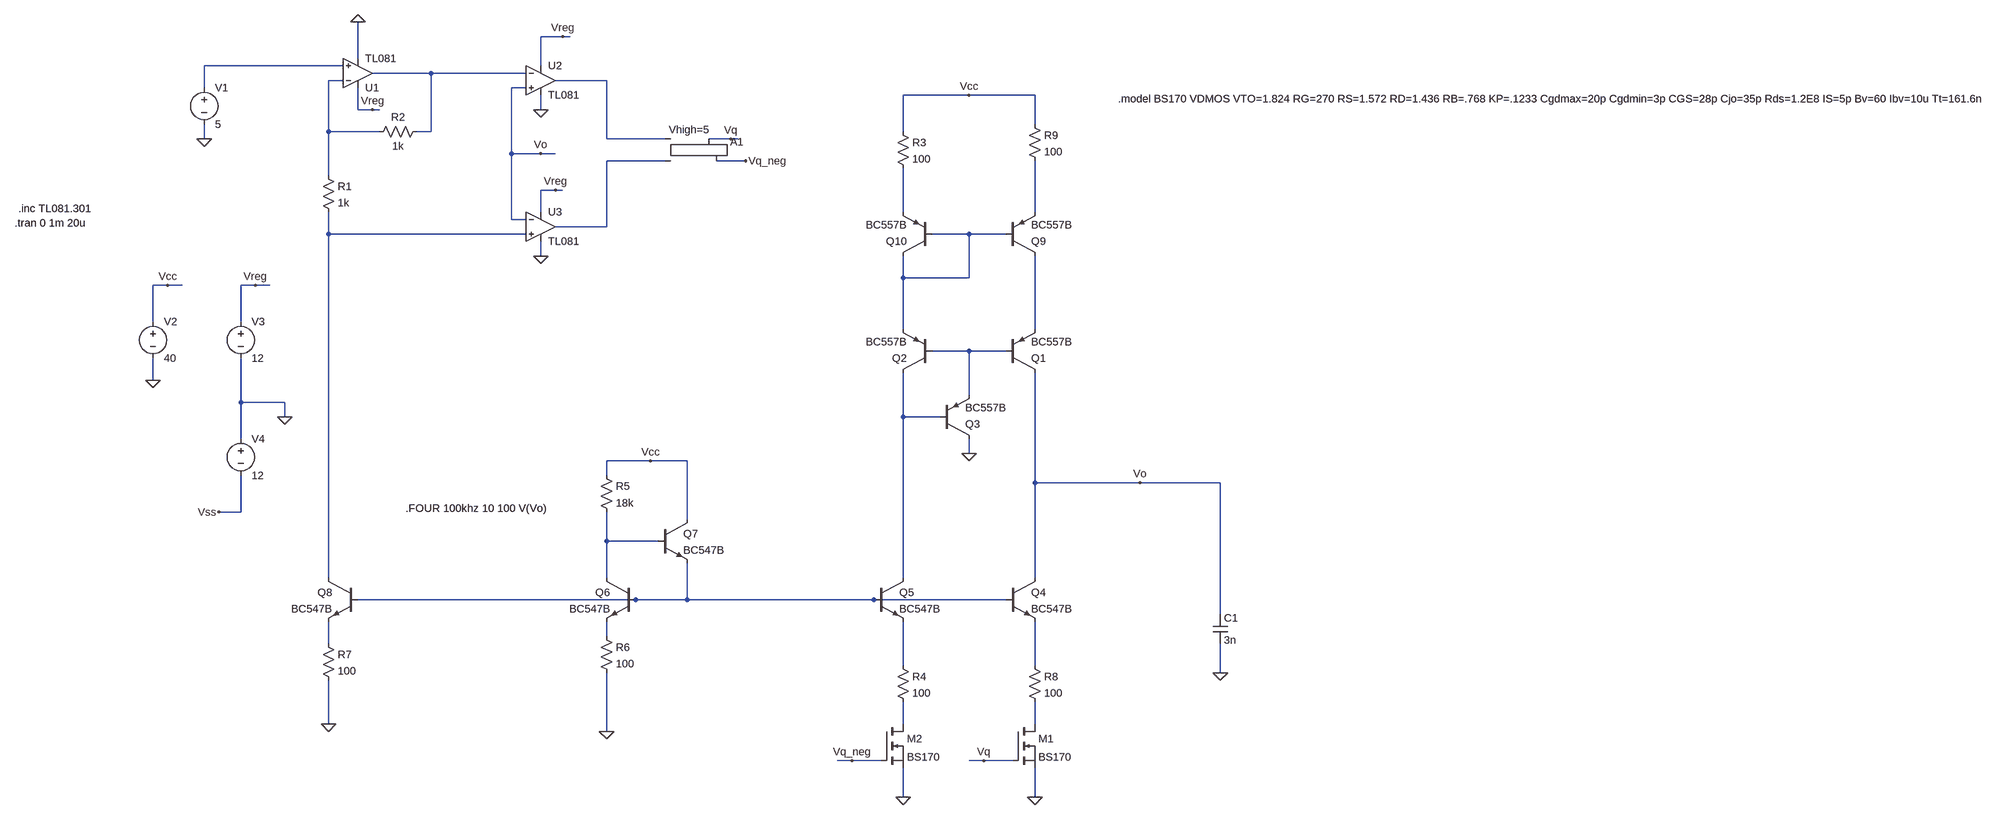
[diagram p0: schematic GeneradorTriangular.asc]
GeneradorTriangular.asc, the LTspice schematic file:
Version 4
SHEET 1 3532 1220
WIRE 160 -464 112 -464
WIRE 176 -464 160 -464
WIRE -288 -416 -288 -496
WIRE -320 -400 -624 -400
WIRE 112 -400 112 -464
WIRE -128 -384 -256 -384
WIRE 80 -384 -128 -384
WIRE -320 -368 -352 -368
WIRE 256 -368 144 -368
WIRE -624 -352 -624 -400
WIRE 80 -352 48 -352
WIRE 1232 -336 1088 -336
WIRE 1376 -336 1232 -336
WIRE -288 -304 -288 -352
WIRE -256 -304 -288 -304
WIRE -240 -304 -256 -304
WIRE 112 -304 112 -336
WIRE 1376 -272 1376 -336
WIRE -352 -256 -352 -368
WIRE -240 -256 -352 -256
WIRE -128 -256 -128 -384
WIRE -128 -256 -160 -256
WIRE 1088 -256 1088 -336
WIRE -624 -240 -624 -272
WIRE 256 -240 256 -368
WIRE 384 -240 256 -240
WIRE 528 -240 480 -240
WIRE 544 -240 528 -240
WIRE 48 -208 48 -352
WIRE 112 -208 48 -208
WIRE 144 -208 112 -208
WIRE 384 -192 256 -192
WIRE 560 -192 496 -192
WIRE -352 -160 -352 -256
WIRE 144 -128 112 -128
WIRE 160 -128 144 -128
WIRE 112 -80 112 -128
WIRE 1088 -80 1088 -176
WIRE 1376 -80 1376 -192
WIRE 48 -64 48 -208
WIRE 80 -64 48 -64
WIRE 256 -48 256 -192
WIRE 256 -48 144 -48
WIRE -352 -32 -352 -80
WIRE 80 -32 -352 -32
WIRE 1232 -32 1152 -32
WIRE 1312 -32 1232 -32
WIRE 112 16 112 -16
WIRE 1088 64 1088 16
WIRE 1232 64 1232 -32
WIRE 1232 64 1088 64
WIRE -704 80 -736 80
WIRE -672 80 -704 80
WIRE -512 80 -544 80
WIRE -480 80 -512 80
WIRE -736 160 -736 80
WIRE -544 160 -544 80
WIRE 1088 176 1088 64
WIRE 1376 176 1376 16
WIRE 1232 224 1152 224
WIRE 1312 224 1232 224
WIRE -736 288 -736 240
WIRE 1232 320 1232 224
WIRE -544 336 -544 240
WIRE -448 336 -544 336
WIRE -448 368 -448 336
WIRE 1088 368 1088 272
WIRE 1168 368 1088 368
WIRE -544 416 -544 336
WIRE 1232 448 1232 416
WIRE 352 464 256 464
WIRE 432 464 352 464
WIRE 256 496 256 464
WIRE 1376 512 1376 272
WIRE 1664 512 1376 512
WIRE 1840 512 1664 512
WIRE -544 576 -544 496
WIRE -544 576 -592 576
WIRE 432 592 432 464
WIRE 256 640 256 576
WIRE 368 640 256 640
WIRE -352 720 -352 -32
WIRE 256 720 256 640
WIRE 1088 720 1088 368
WIRE 1376 720 1376 512
WIRE 320 768 -288 768
WIRE 432 768 432 688
WIRE 432 768 320 768
WIRE 1024 768 432 768
WIRE 1312 768 1024 768
WIRE 1840 800 1840 512
WIRE 256 848 256 816
WIRE -352 864 -352 816
WIRE 1088 912 1088 816
WIRE 1376 912 1376 816
WIRE 1840 928 1840 864
WIRE -352 1040 -352 944
WIRE 1088 1040 1088 992
WIRE 1376 1040 1376 992
WIRE 256 1056 256 928
WIRE 976 1120 944 1120
WIRE 1040 1120 976 1120
WIRE 1264 1120 1232 1120
WIRE 1328 1120 1264 1120
WIRE 1088 1200 1088 1136
WIRE 1376 1200 1376 1136
FLAG 1840 928 0
FLAG -736 288 0
FLAG -624 -240 0
FLAG -704 80 Vcc
FLAG -256 -304 Vreg
FLAG 160 -464 Vreg
FLAG 144 -128 Vreg
FLAG 528 -240 Vq
FLAG 1664 512 Vo
FLAG 112 -208 Vo
FLAG 1232 448 0
FLAG 1232 -336 Vcc
FLAG 1376 1200 0
FLAG 1264 1120 Vq
FLAG 256 1056 0
FLAG 352 464 Vcc
FLAG -352 1040 0
FLAG -512 80 Vreg
FLAG -448 368 0
FLAG -592 576 Vss
FLAG 1088 1200 0
FLAG 976 1120 Vq_neg
FLAG 560 -192 Vq_neg
FLAG 112 16 0
FLAG 112 -304 0
FLAG -288 -496 0
SYMBOL res -368 -176 R0
SYMATTR InstName R1
SYMATTR Value 1k
SYMBOL res -144 -272 R90
WINDOW 0 0 56 VBottom 2
WINDOW 3 32 56 VTop 2
SYMATTR InstName R2
SYMATTR Value 1k
SYMBOL cap 1824 800 R0
SYMATTR InstName C1
SYMATTR Value 3n
SYMBOL voltage -624 -368 R0
WINDOW 123 0 0 Left 2
WINDOW 39 0 0 Left 2
SYMATTR InstName V1
SYMATTR Value 5
SYMBOL voltage -736 144 R0
WINDOW 123 0 0 Left 2
WINDOW 39 0 0 Left 2
SYMATTR InstName V2
SYMATTR Value 40
SYMBOL Digital\\srflop 432 -288 R0
WINDOW 3 -40 28 Left 2
SYMATTR Value Vhigh=5
SYMATTR InstName A1
SYMBOL nmos 1328 1040 R0
SYMATTR InstName M1
SYMATTR Value BS170
SYMBOL pnp 1312 272 M180
SYMATTR InstName Q1
SYMATTR Value BC557B
SYMBOL pnp 1152 272 R180
SYMATTR InstName Q2
SYMATTR Value BC557B
SYMBOL pnp 1168 416 M180
SYMATTR InstName Q3
SYMATTR Value BC557B
SYMBOL res 1072 -272 R0
SYMATTR InstName R3
SYMATTR Value 100
SYMBOL npn 1312 720 R0
SYMATTR InstName Q4
SYMATTR Value BC547B
SYMBOL npn 1024 720 R0
SYMATTR InstName Q5
SYMATTR Value BC547B
SYMBOL npn 320 720 M0
SYMATTR InstName Q6
SYMATTR Value BC547B
SYMBOL npn 368 592 R0
SYMATTR InstName Q7
SYMATTR Value BC547B
SYMBOL res 240 480 R0
SYMATTR InstName R5
SYMATTR Value 18k
SYMBOL res 240 832 R0
SYMATTR InstName R6
SYMATTR Value 100
SYMBOL npn -288 720 M0
SYMATTR InstName Q8
SYMATTR Value BC547B
SYMBOL res -368 848 R0
SYMATTR InstName R7
SYMATTR Value 100
SYMBOL voltage -544 144 R0
WINDOW 123 0 0 Left 2
WINDOW 39 0 0 Left 2
SYMATTR InstName V3
SYMATTR Value 12
SYMBOL Opamps\\opamp2 -288 -320 M180
SYMATTR InstName U1
SYMATTR Value TL081
SYMBOL Opamps\\opamp2 112 -432 R0
SYMATTR InstName U2
SYMATTR Value TL081
SYMBOL Opamps\\opamp2 112 -112 R0
SYMATTR InstName U3
SYMATTR Value TL081
SYMBOL voltage -544 400 R0
WINDOW 123 0 0 Left 2
WINDOW 39 0 0 Left 2
SYMATTR InstName V4
SYMATTR Value 12
SYMBOL res 1360 896 R0
SYMATTR InstName R8
SYMATTR Value 100
SYMBOL nmos 1040 1040 R0
SYMATTR InstName M2
SYMATTR Value BS170
SYMBOL res 1072 896 R0
SYMATTR InstName R4
SYMATTR Value 100
SYMBOL res 1360 -288 R0
SYMATTR InstName R9
SYMATTR Value 100
SYMBOL pnp 1312 16 M180
SYMATTR InstName Q9
SYMATTR Value BC557B
SYMBOL pnp 1152 16 R180
SYMATTR InstName Q10
SYMATTR Value BC557B
TEXT -1072 -56 Left 2 !.tran 0 1m 20u
TEXT -1064 -88 Left 2 !.inc TL081.301
TEXT -184 568 Left 2 !.FOUR 100khz 10 100 V(Vo)
TEXT 1616 -328 Left 2 !.model BS170 VDMOS VTO=1.824 RG=270 RS=1.572 RD=1.436 RB=.768 KP=.1233 Cgdmax=20p Cgdmin=3p CGS=28p Cjo=35p Rds=1.2E8 IS=5p Bv=60 Ibv=10u Tt=161.6n

The netlist it stands for:
* GeneradorTriangular.asc
R1 N003 N008 1k
R2 N002 N003 1k
C1 Vo 0 3n
V1 N001 0 5
V2 Vcc 0 40
A1 N004 N005 0 0 0 Vq_neg Vq 0 SRFLOP Vhigh=5
M1 N020 Vq 0 0 BS170
Q1 Vo N011 N010 0 BC557B
Q2 N012 N011 N009 0 BC557B
Q3 0 N012 N011 0 BC557B
R3 Vcc N006 100
Q4 Vo N014 N018 0 BC547B
Q5 N012 N014 N017 0 BC547B
Q6 N013 N014 N015 0 BC547B
Q7 Vcc N013 N014 0 BC547B
R5 Vcc N013 18k
R6 N015 0 100
Q8 N008 N014 N016 0 BC547B
R7 N016 0 100
V3 Vreg 0 12
XU1 N001 N003 Vreg 0 N002 TL081  ; pins In+ In- V+ V- OUT
XU2 Vo N002 Vreg 0 N004 TL081  ; pins In+ In- V+ V- OUT
XU3 N008 Vo Vreg 0 N005 TL081  ; pins In+ In- V+ V- OUT
V4 0 Vss 12
R8 N018 N020 100
M2 N019 Vq_neg 0 0 BS170
R4 N017 N019 100
R9 Vcc N007 100
Q9 N010 N009 N007 0 BC557B
Q10 N009 N009 N006 0 BC557B
.model NPN NPN
.model PNP PNP
.lib standard.bjt
.model NMOS NMOS
.model PMOS PMOS
.lib standard.mos
.tran 0 1m 20u
.inc TL081.301
.FOUR 100khz 10 100 V(Vo)
.model BS170 VDMOS VTO=1.824 RG=270 RS=1.572 RD=1.436 RB=.768 KP=.1233 Cgdmax=20p Cgdmin=3p CGS=28p Cjo=35p Rds=1.2E8 IS=5p Bv=60 Ibv=10u Tt=161.6n
.backanno
.end